# EAGLE design annoy-o-tron (EAGLE 7.7.0)
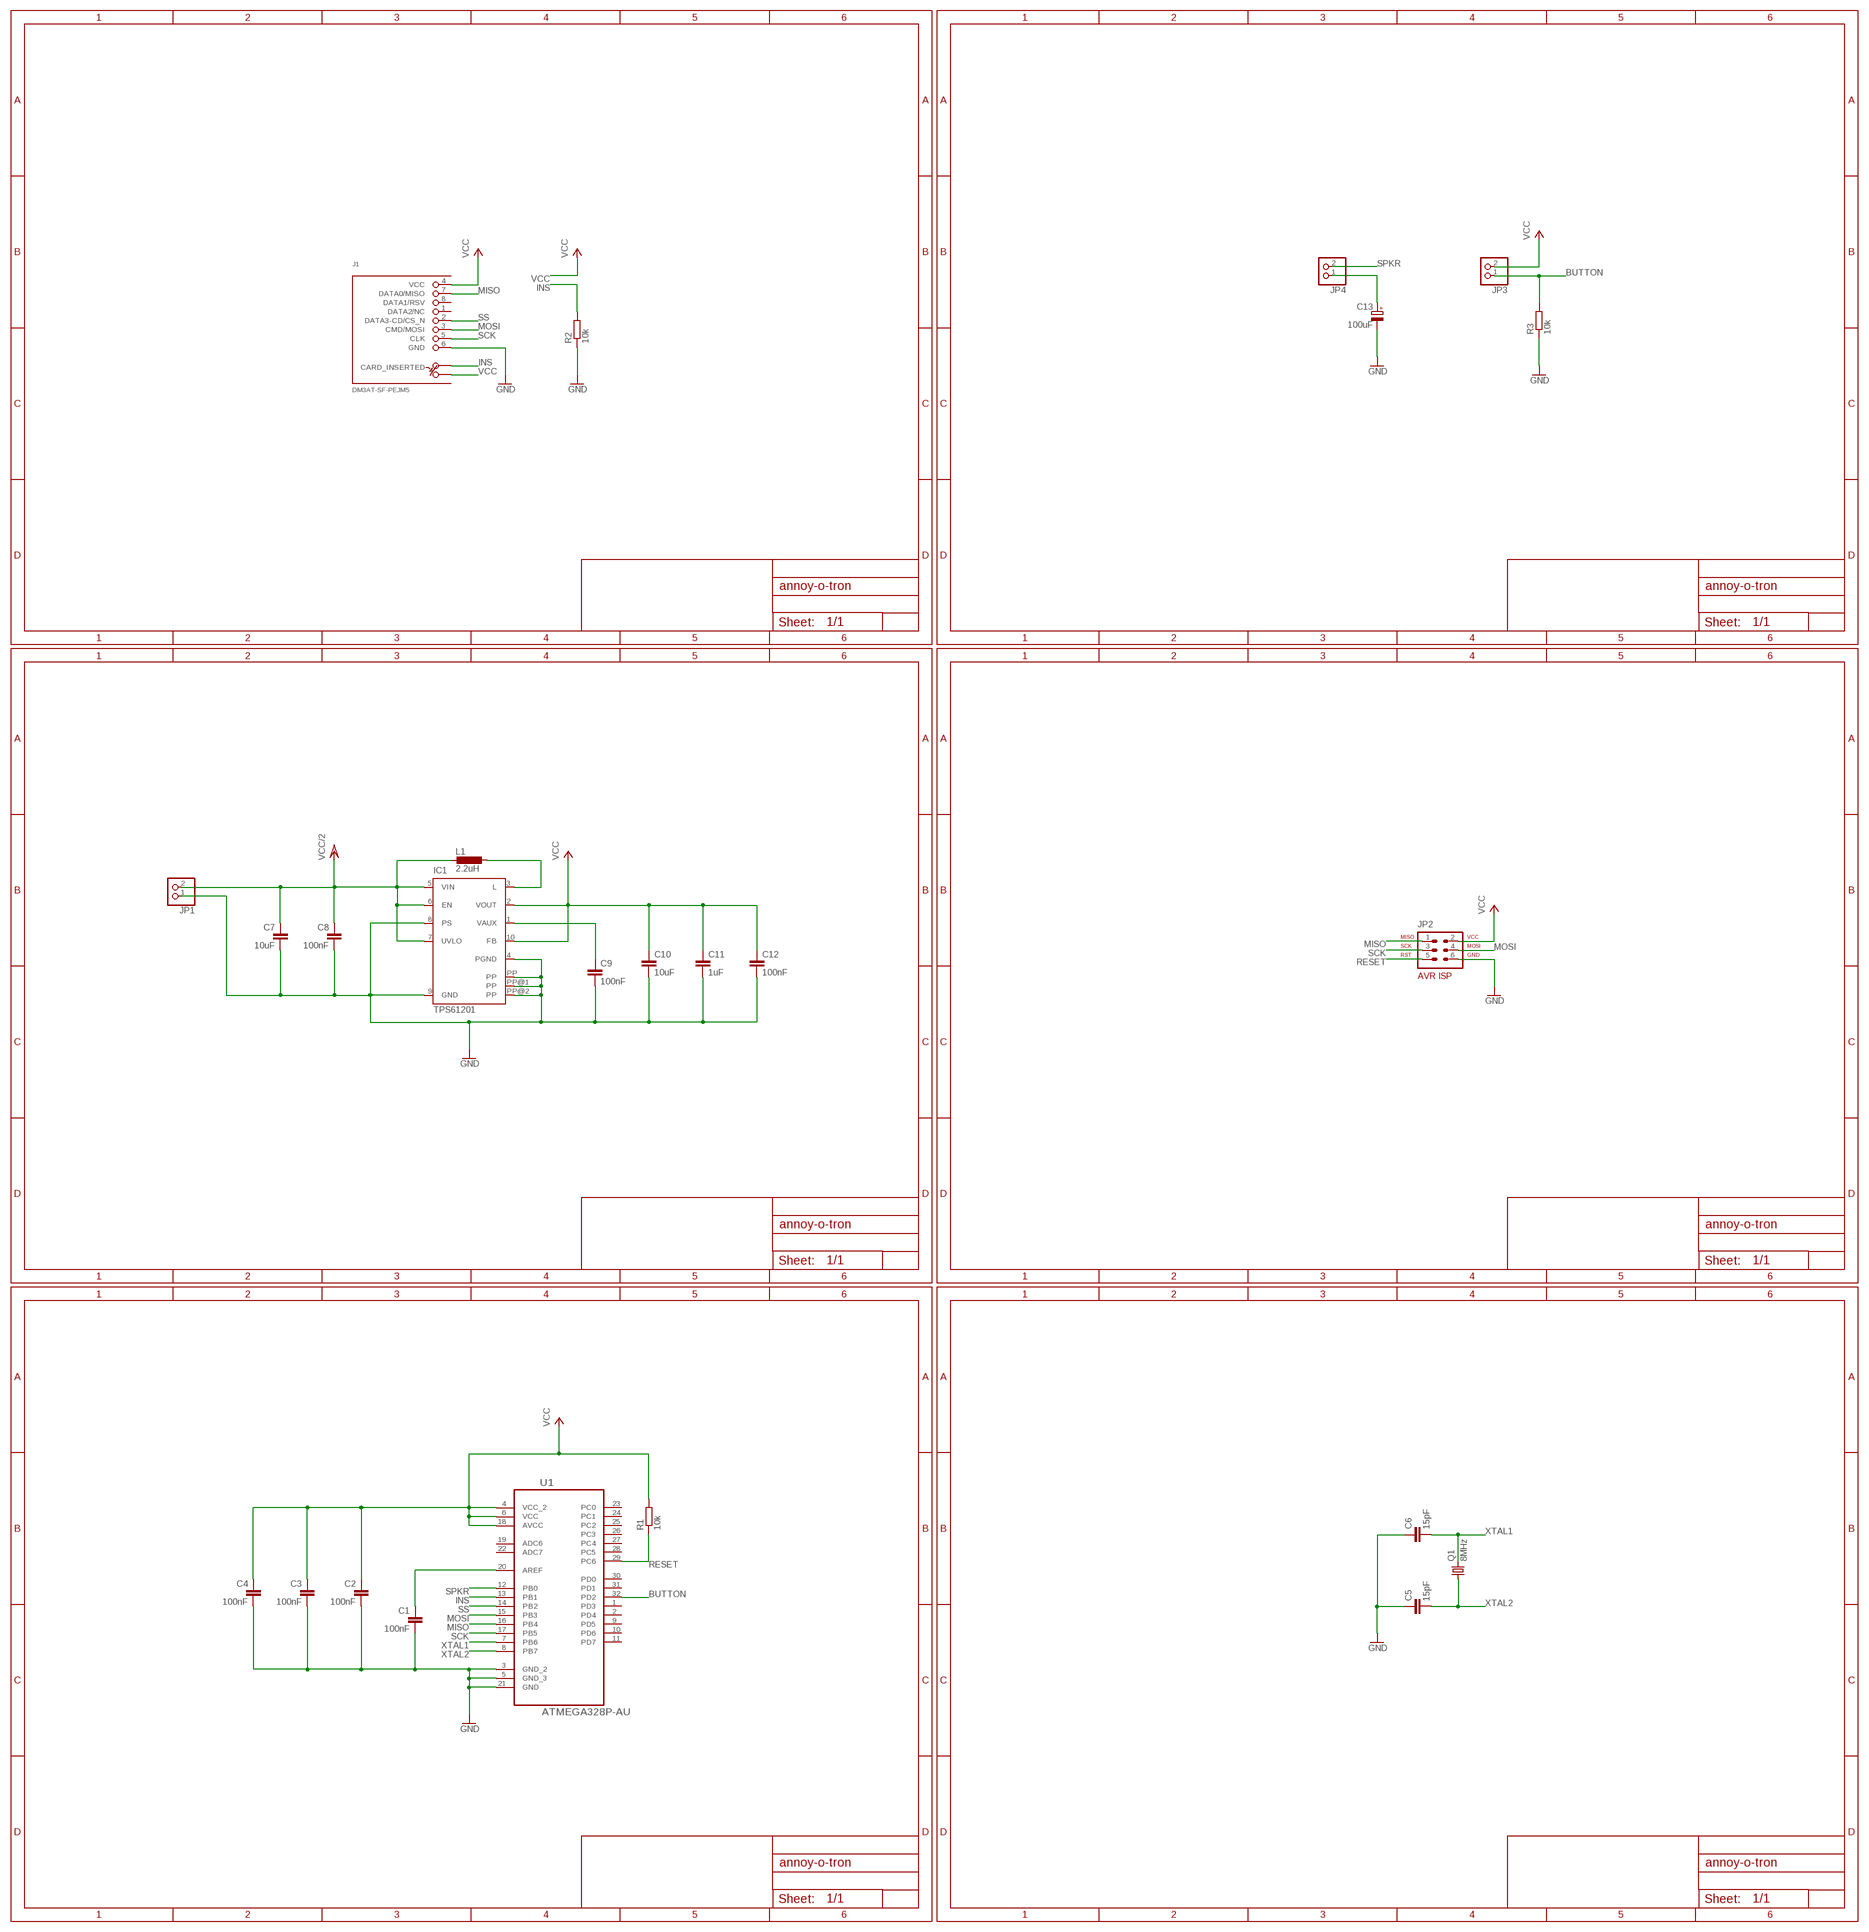
[diagram p0: schematic, sheet 1]

## Parts
C1  100nF  C-EUC0805K  [C0805K]
C2  100nF  C-EUC0805K  [C0805K]
C3  100nF  C-EUC0805K  [C0805K]
C4  100nF  C-EUC0805K  [C0805K]
C5  15pF  C-EUC0805K  [C0805K]
C6  15pF  C-EUC0805K  [C0805K]
C7  10uF  C-EUC0805K  [C0805K]
C8  100nF  C-EUC0805K  [C0805K]
C9  100nF  C-EUC0805K  [C0805K]
C10  10uF  C-EUC0805K  [C0805K]
C11  1uF  C-EUC0805K  [C0805K]
C12  100nF  C-EUC0805K  [C0805K]
C13  100uF  CPOL-EU153CLV-0405  [153CLV-0405]
IC1  TPS61201  [S-PDSO-N10]
J1  DM3AT-SF-PEJM5  [DM3AT-SF-PEJM5]
JP1  PINHD-1X2  [1X02]
JP2  AVR-ISP-6VERT  [AVR-ISP-6]
JP3  PINHD-1X2  [1X02]
JP4  PINHD-1X2  [1X02]
L1  2.2uH  SRN3012TA  [SRN3012TA]
Q1  8MHz  CRYSTALHC49S  [HC49/S]
R1  10k  R-EU_R0805  [R0805]
R2  10k  R-EU_R0805  [R0805]
R3  10k  R-EU_R0805  [R0805]
U1  ATMEGA328P-AU  [QFP80P900X900X120-32N]

## Nets
BUTTON: JP3.1 R3.2 U1.32(PD2)
GND: C1.2 C2.2 C3.2 C4.2 C5.1 C6.1 C7.2 C8.2 C9.2 C10.2 C11.2 C12.2 C13.- IC1.4(PGND) IC1.8(PS) IC1.9(GND) IC1.PP IC1.PP@1(PP) IC1.PP@2(PP) J1.6(GND) JP1.1 JP2.6 R2.1 R3.1 U1.3(GND_2) U1.5(GND_3) U1.21(GND)
INS: J1.A R2.2 U1.13(PB1)
MISO: J1.7(DATA0/MISO) JP2.1 U1.16(PB4)
MOSI: J1.3(CMD/MOSI) JP2.4 U1.15(PB3)
N$1: IC1.3(L) L1.P$1
N$2: C1.1 U1.20(AREF)
N$3: C9.1 IC1.1(VAUX)
N$4: C13.+ JP4.1
RESET: JP2.5 R1.1 U1.29(PC6)
SCK: J1.5(CLK) JP2.3 U1.17(PB5)
SPKR: JP4.2 U1.12(PB0)
SS: J1.2(DATA3-CD/CS_N) U1.14(PB2)
VCC: C2.1 C3.1 C4.1 C10.1 C11.1 C12.1 IC1.2(VOUT) IC1.10(FB) J1.4(VCC) J1.B JP2.2 JP3.2 R1.2 U1.4(VCC_2) U1.6(VCC) U1.18(AVCC)
VCC/2: C7.1 C8.1 IC1.5(VIN) IC1.6(EN) IC1.7(UVLO) JP1.2 L1.P$2
XTAL1: C6.2 Q1.2 U1.7(PB6)
XTAL2: C5.2 Q1.1 U1.8(PB7)
Unconnected: J1.1(DATA2/NC) J1.8(DATA1/RSV) U1.1(PD3) U1.2(PD4) U1.9(PD5) U1.10(PD6) U1.11(PD7) U1.19(ADC6) U1.22(ADC7) U1.23(PC0) U1.24(PC1) U1.25(PC2) U1.26(PC3) U1.27(PC4) U1.28(PC5) U1.30(PD0) U1.31(PD1)

## Library data of the parts
C1-C12 = rcl:C-EU: CAPACITOR, European symbol
C13 = rcl:CPOL-EU: POLARIZED CAPACITOR, European symbol
IC1 = texas:TPS6120*: LOW INPUT VOLTAGE SYNCHRONOUS BOOST CONVERTER WITH 1.3-A SWITCHES Source: http://focus.ti.com/lit/ds/symlink/tps61200.pdf; MPN: TPS61201DRCT; OC_FARNELL: unknown; OC_NEWARK: 37M0068
J1 = DM3AT-SF-PEJM5:DM3AT-SF-PEJM5: CONN MICRO SD R/A PUSH-PUSH SMD
JP1 JP3 JP4 = pinhead:PINHD-1X2: PIN HEADER
JP2 = avr-7:AVR-ISP-6: AVR ISP-6 Serial Programming Header
L1 = tudor:SRN3012TA
Q1 = crystal:CRYSTAL: CRYSTAL; OC_FARNELL: 1667008; OC_NEWARK: unknown
R1-R3 = rcl:R-EU_: RESISTOR, European symbol
U1 = tudor:ATMEGA328P-AU: 8-bit Microcontroller with In-System Programmable Flash; MPN: ATMEGA328P-AU; OC_FARNELL: 1715486; OC_NEWARK: 14R4631; PACKAGE: TQFP-32; SUPPLIER: Atmel

## Board
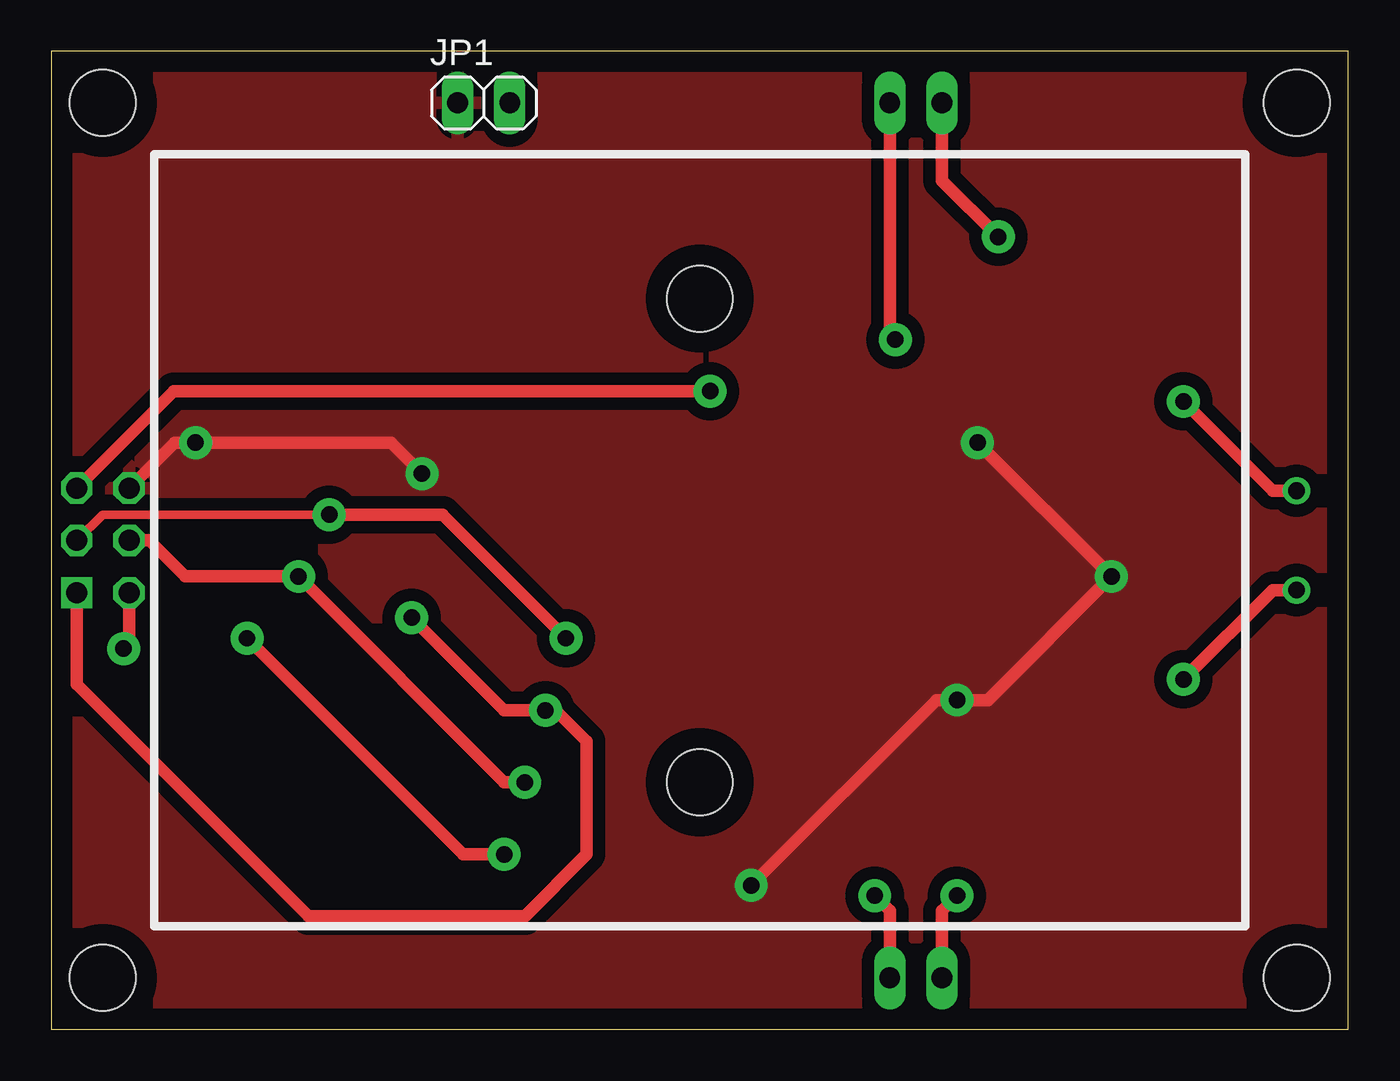
[diagram p1: board, top side]
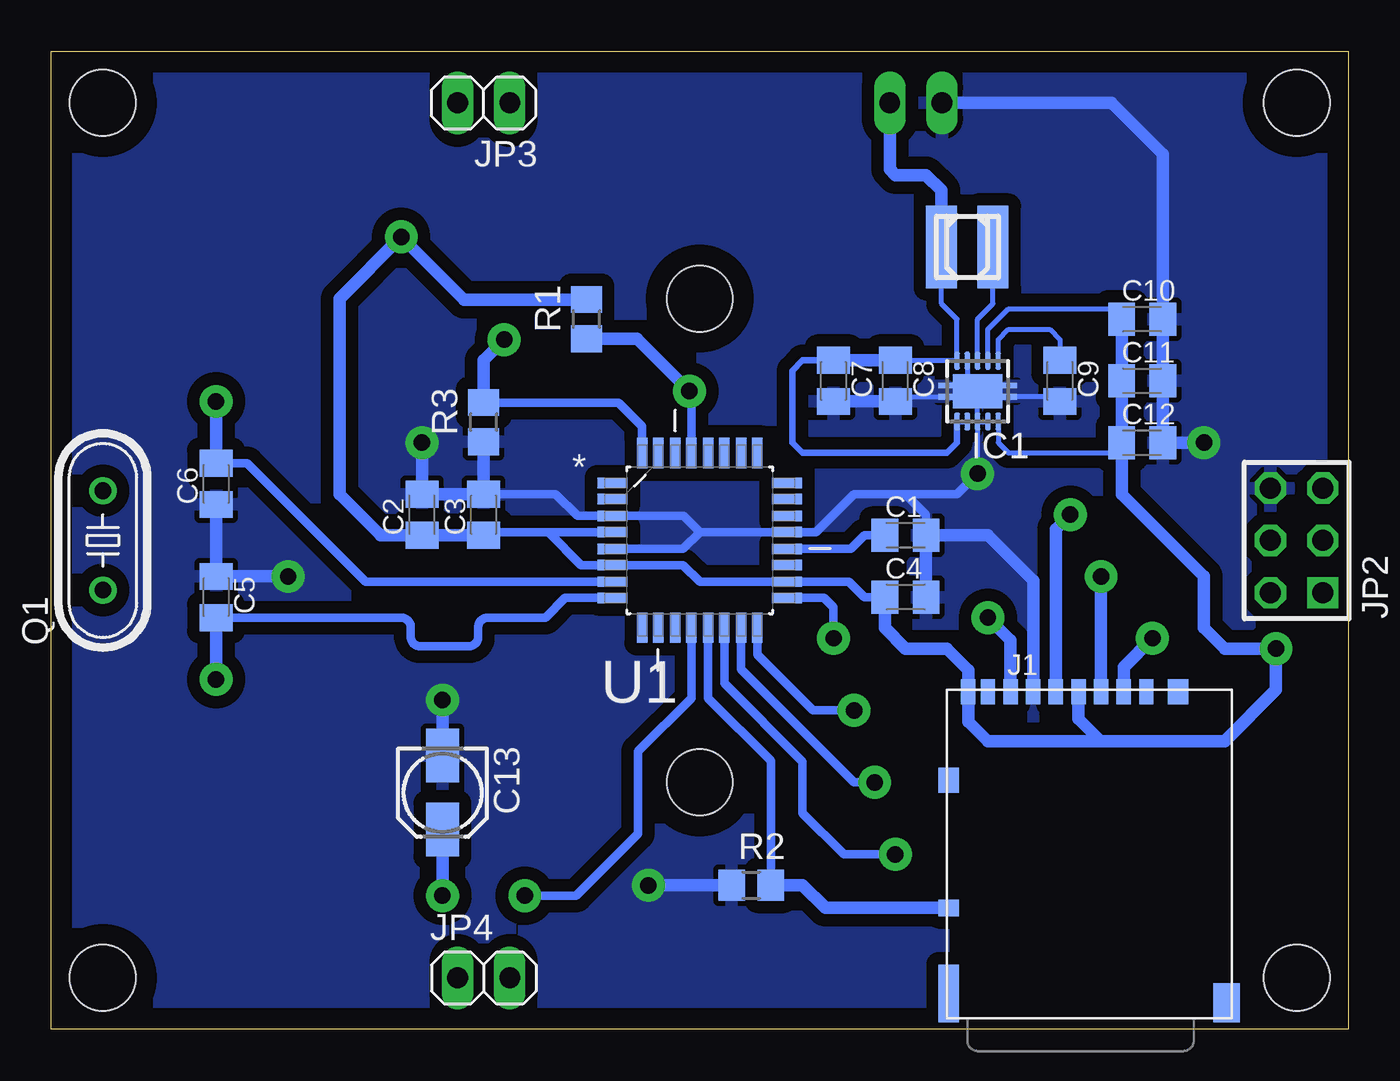
[diagram p2: board, bottom side, seen from below]

Size 63 x 47.5 mm. Coordinates in mm from the lower left corner, seen from the top.
Outline: 0,0 63,0 63,47.5 0,47.5 0,0
Copper layers (1*16): Top 0.035mm / dielectric 1.5mm / Bottom 0.035mm
Design rules "default *": minimum track width 10mil, minimum drill 24mil, track to track 8mil, track to pad 8mil, pad to pad 8mil, via to via 8mil, smd to smd 8mil, copper to edge 40mil, drill to drill 8mil, minimum pad ring 10mil, minimum via ring 8mil, stop-mask expansion 4mil, vias tented up to drill 0mil, thermal gap 10mil
Holes 3.2 mm at 31.5,12 31.5,35.5 2.5,2.5 60.5,2.5 2.5,45 60.5,45

### Footprints (pad centres in the part's own frame; a part is rotated, then mirrored left to right if it is on the bottom)
C0805K = smd 1.3 x 1.6: 1 -1,0; 2 1,0
153CLV-0405 = smd 2.6 x 1.6: + 1.8,0; - -1.8,0
S-PDSO-N10 = smd 0.28 x 0.85: 1 -1,-1.475; 2 -0.5,-1.475; 3 0,-1.475; 4 0.5,-1.475; 5 1,-1.475; 6 1,1.475; 7 0.5,1.475; 8 0,1.475; 9 -0.5,1.475; 10 -1,1.475 | smd 2.4 x 1.65: PP 0,0 | smd 3.8 x 0.28: PP@1 0,0.275; PP@2 0,-0.275
DM3AT-SF-PEJM5 = smd 0.7 x 1.2: 1 3.2,-0.1; 2 2.1,-0.1; 3 1,-0.1; 4 -0.1,-0.1; 5 -1.2,-0.1; 6 -2.3,-0.1; 7 -3.4,-0.1; 8 -4.5,-0.1; B -5.45,-0.1 | smd 1 x 0.8: A -6.4,-10.6 | smd 1 x 1.2: MOUNT0 4.75,-0.1; MOUNT1 -6.4,-4.4 | smd 1 x 2.8: MOUNT2 -6.4,-14.75 | smd 1.3 x 1.9: MOUNT3 7.1,-15.2
1X02 = drill 1.016 long: 1 -1.27,0; 2 1.27,0
AVR-ISP-6 = drill 1.016 square: 1 -2.54,-1.27 | drill 1.016 octagon: 2 -2.54,1.27; 3 0,-1.27; 4 0,1.27; 5 2.54,-1.27; 6 2.54,1.27
SRN3012TA = smd 1.5 x 4: P$1 -1.25,0; P$2 1.25,0
HC49/S = drill 0.813: 1 -2.413,0; 2 2.413,0
R0805 = smd 1.3 x 1.5: 1 -0.95,0; 2 0.95,0
QFP80P900X900X120-32N = smd 1.473 x 0.508: 1 -4.242,2.794; 2 -4.242,2.007; 3 -4.242,1.194; 4 -4.242,0.406; 5 -4.242,-0.406; 6 -4.242,-1.194; 7 -4.242,-2.007; 8 -4.242,-2.794; 17 4.242,-2.794; 18 4.242,-2.007; 19 4.242,-1.194; 20 4.242,-0.406; 21 4.242,0.406; 22 4.242,1.194; 23 4.242,2.007; 24 4.242,2.794 | smd 0.508 x 1.473: 9 -2.794,-4.242; 10 -2.007,-4.242; 11 -1.194,-4.242; 12 -0.406,-4.242; 13 0.406,-4.242; 14 1.194,-4.242; 15 2.007,-4.242; 16 2.794,-4.242; 25 2.794,4.242; 26 2.007,4.242; 27 1.194,4.242; 28 0.406,4.242; 29 -0.406,4.242; 30 -1.194,4.242; 31 -2.007,4.242; 32 -2.794,4.242

### Placement (x,y rotation side)
C1  21.5,24 0 bottom
C2  45,25 90 bottom
C3  42,25 90 bottom
C4  21.5,21 0 bottom
C5  55,21 270 bottom
C6  55,26.5 90 bottom
C7  25,31.5 270 bottom
C8  22,31.5 270 bottom
C9  14,31.5 270 bottom
C10  10,34.5 0 bottom
C11  10,31.5 0 bottom
C12  10,28.5 0 bottom
C13  44,11.5 270 bottom
IC1  18,31 180 bottom
J1  13,16.5 0 bottom
JP1  21,45 0 top
JP2  2.5,23.75 90 bottom
JP3  42,45 180 bottom
JP4  42,2.5 0 bottom
L1  18.5,38 180 bottom
Q1  60.5,23.75 90 bottom
R1  37,34.5 90 bottom
R2  29,7 0 bottom
R3  42,29.5 90 bottom
U1  31.5,23.75 0 bottom

### Tracks (layer width: path | path; a pad name or v marks a point on that pad's centre or on a via)
BUTTON  (via drill 0.8 pad 1.6)
  Top 0.61: JP3.1 40.73,33.77 v41,33.5
  Bottom 0.406: R3.2 35.45,30.45 34.29,29.29 U1.32
  Bottom 0.61: R3.2 42,32.5 v41,33.5
GND  (via drill 0.8 pad 1.6)
  Top 0.61: v45,28.5 v51.5,22 45.5,16 v44,16 43,16 v34,7 | v18,27 16.5,28.5 v7,28.5 5.98,28.5 JP2.6
  Bottom 0.254: IC1.8 IC1.9 | IC1.8 IC1.PP@1 | IC1.4 18.5,31.77 IC1.PP@2 | C9.2 14.22,30.73 IC1.PP@1 | C8.2 21.77,30.73 IC1.PP@1 | IC1.8 v18,27
  Bottom 0.406: 31.5,24.16 U1.21 25.84,24.16 24,26 21.5,26 | 31.5,24.16 32.29,24.94 U1.3 37.44,24.94 38.5,26 C3.2 | U1.5 32.31,23.34 31.5,24.16 | 21.5,26 20.5,25 C1.2 | 21.5,26 19,26 v18,27
  Bottom 0.61: C6.1 C5.1 v51.5,22 | R3.1 C3.2 C2.2 v45,28.5 | C13.- v44,16 | R2.1 v34,7 | J1.6 15.3,21.8 17.5,24 C1.2 C4.2 | C7.2 C8.2 | C10.2 C11.2 | C11.2 C12.2 v7,28.5 | C11.2 9,42.5 11.5,45 JP1.1
  pour Top (isolate 0.61): 0,0 0,47.5 63,47.5 63,0
  pour Bottom (isolate 0.61): 0,0 0,47.5 63,47.5 63,0
INS
  Bottom 0.406: U1.13 31.09,16.09 28.05,13.05 R2.2
  Bottom 0.61: J1.A 25.4,5.9 26.5,7 R2.2
MISO  (via drill 0.8 pad 1.6)
  Top 0.61: v17.5,20 22,15.5 v24,15.5 24.5,15.5 26,14 26,8.5 23,5.5 12.5,5.5 1.23,16.77 JP2.1
  Bottom 0.406: U1.16 28.71,18.21 26,15.5 v24,15.5
  Bottom 0.61: J1.7 16.4,18.9 v17.5,20
MOSI  (via drill 0.8 pad 1.6)
  Top 0.61: JP2.4 4.75,23.75 6.5,22 v12,22 22,12 v23,12
  Bottom 0.406: U1.15 29.49,17.49 24,12 v23,12
  Bottom 0.61: J1.3 v12,22
N$1
  Bottom 0.254: IC1.3 18,34.5 17.25,35.25 L1.P$1
N$2
  Bottom 0.406: U1.20 24.16,23.34 23.5,24 C1.1
N$3
  Bottom 0.254: IC1.1 17,33.5 16.5,34 14.5,34 14,33.5 C9.1
N$4  (via drill 0.8 pad 1.6)
  Top 0.61: JP4.1 43.27,5.77 v44,6.5
  Bottom 0.61: C13.+ v44,6.5
RESET  (via drill 0.8 pad 1.6)
  Top 0.61: v32,31 5.94,31 JP2.5
  Bottom 0.406: U1.29 31.91,30.91 v32,31
  Bottom 0.61: R1.1 34.55,33.55 v32,31
SCK  (via drill 0.8 pad 1.6)
  Top 0.406: JP2.3 2.48,25 v13.5,25
  Top 0.61: v13.5,25 19,25 v25,19
  Bottom 0.406: U1.17 25.46,20.96 25,20.5 v25,19
  Bottom 0.61: J1.5 14.2,24.3 v13.5,25
SPKR  (via drill 0.8 pad 1.6)
  Top 0.61: JP4.2 40.73,5.77 v40,6.5
  Bottom 0.406: U1.12 31.91,16.09 34.5,13.5 34.5,9.5 37.5,6.5 v40,6.5
SS  (via drill 0.8 pad 1.6)
  Top 0.61: v22,8.5 20,8.5 v9.5,19
  Bottom 0.406: U1.14 30.31,16.81 26.5,13 26.5,10.5 24.5,8.5 v22,8.5
  Bottom 0.61: J1.2 10.9,17.6 v9.5,19
VCC  (via drill 0.8 pad 1.6)
  Top 0.61: JP3.2 43.27,41.23 v46,38.5 | JP2.2 3.77,18.77 v3.5,18.5
  Bottom 0.254: IC1.10 17,28.5 16.5,28 11.5,28 C12.1 | IC1.2 17.5,34 16.5,35 11.5,35 C10.1
  Bottom 0.406: 38.86,24.16 42,24.16 C3.1 | 38.86,24.16 U1.4 | 38.86,24.16 37.26,22.56 U1.6 32.31,22.56 31.5,21.74 U1.18 24.24,21.74 23.5,21 C4.1
  Bottom 0.61: C3.1 C2.1 47,24 49,26 49,35.5 v46,38.5 42.95,35.45 R1.2 | 12,14 6,14 3.5,16.5 v3.5,18.5 6,18.5 7,19.5 7,22 11,26 C12.1 C11.1 C10.1 | 12,14 17.5,14 18.45,14.95 J1.B 18.45,17.45 19.5,18.5 21.5,18.5 22.5,19.5 C4.1 | J1.4 13.1,15.1 12,14
VCC/2
  Bottom 0.254: IC1.6 IC1.7 | L1.P$2 19.75,35.25 19,34.5 IC1.5 21.98,32.48 C8.1
  Bottom 0.305: IC1.6 19,28.5 19.5,28 26.5,28 27,28.5 27,32 26.5,32.5 C7.1
  Bottom 0.61: C8.1 C7.1 | L1.P$2 19.75,40.75 20.5,41.5 22,41.5 22.27,41.77 JP1.2
XTAL1  (via drill 0.8 pad 1.6)
  Top 0.61: v55,30.5 59.34,26.16 Q1.2
  Bottom 0.406: C6.2 53.5,27.5 47.74,21.74 U1.7
  Bottom 0.61: v55,30.5 C6.2
XTAL2  (via drill 0.8 pad 1.6)
  Top 0.61: v55,17 59.34,21.34 Q1.1
  Bottom 0.406: U1.8 38.04,20.96 39,20 41.8,20 arc-90 42.26,19.54 42.26,19.07 arc90 42.72,18.61 45.09,18.61 arc90 45.54,19.07 45.54,19.54 arc-90 46,20 C5.2
  Bottom 0.61: v55,17 C5.2